# Altium project PnP_Carriage.PrjPcb
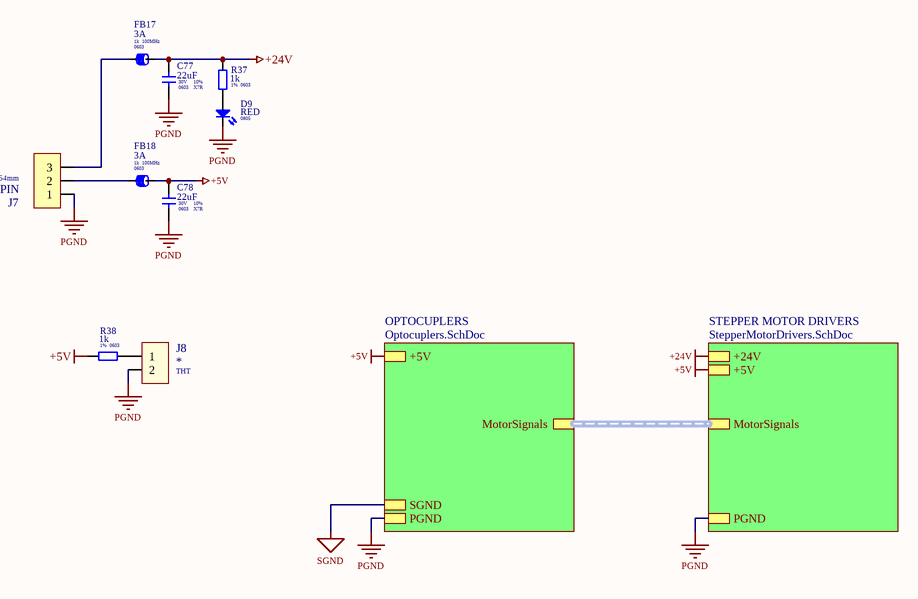
[diagram p0: Root.SchDoc]
3 sheets, 139 parts. Net scope: hierarchical (ports join the sheet entries above them; power ports are global).
Board file: PCB.PcbDoc
Sheets:
  Root.SchDoc
    STEPPER MOTOR DRIVERS = StepperMotorDrivers.SchDoc
    OPTOCUPLERS = Optocuplers.SchDoc

## Sheet Root.SchDoc
size A4; SheetNumber: 1; SheetTotal: 3

### Parts
C77  value 22uF  DielectricType: X7R  Voltage: 30V  Tolerant: 10%  Package: 0603  [CAPC1608X06L]  (hidden comment: 22uF/30V)
C78  value 22uF  DielectricType: X7R  Voltage: 30V  Tolerant: 10%  Package: 0603  [CAPC1608X06L]  (hidden comment: 22uF/30V)
D9  Package: 0805  [DIOMELF1608L]  (hidden comment: RED)
FB17  Min Frequency: 100MHz  Impedance: 1k  Package: 0603  [INDC1608X06N]  (hidden comment: 3A)
FB18  Min Frequency: 100MHz  Impedance: 1k  Package: 0603  [INDC1608X06L]  (hidden comment: 3A)
J7  Package: 2.54mm  [B3B-PH-K-S]  (hidden comment: 3PIN)
J8  Package: THT  [B2B-PH-K-S]  (hidden comment: *)
R37  value 1k  Package: 0603  Tolerance: 1%  [RESC1608X06L]  (hidden comment: 1k 1%)
R38  value 1k  Package: 0603  Tolerance: 1%  [RESC1608X06L]  (hidden comment: 1k 1%)

### Sub-sheets
OPTOCUPLERS = Optocuplers.SchDoc: MotorSignals (harness MotorDriverSignals), +5V, PGND, SGND
STEPPER MOTOR DRIVERS = StepperMotorDrivers.SchDoc: +5V, PGND, +24V, MotorSignals (harness MotorDriverSignals)

### Nets
+5V: C78.2 FB18.2 R38.2 ; sheet STEPPER MOTOR DRIVERS/+5V, sheet OPTOCUPLERS/+5V
+24V: C77.2 FB17.2 R37.2 ; sheet STEPPER MOTOR DRIVERS/+24V
PGND: C77.1 C78.1 D9.2(K) J7.1 J8.2 ; sheet STEPPER MOTOR DRIVERS/PGND, sheet OPTOCUPLERS/PGND
NetD9_1: D9.1(A) R37.1
NetFB17_1: FB17.1 J7.3
NetFB18_1: FB18.1 J7.2
NetJ8_1: J8.1 R38.1

### Buses and harness runs
harness sheet OPTOCUPLERS/MotorSignals = sheet STEPPER MOTOR DRIVERS/MotorSignals

### Notes on the sheet
- Title:
- Size:
- Sheet:
- Revision:
- A4
- of
- SCHEMATIC DIAGRAM
- Variant:
- DrawnBy:
- CheckedBy:
- www.destechnology.pl <http://www.destechnology.pl>
- Date:
- File:

### Library data of the parts
C77 C78 = C: Supplier Part Number 1: *
D9 = D_LED: pin to pad: 1>2 2>1; manufacture: *; helpurl: *; Supplier Part Number 1: *; value: RED
FB17 FB18 = FB_1: Ferrite bead - 2-nd Symbol; manufacture: *; helpurl: *; Supplier Part Number 1: *; value: 3A
J7 = CON_3PIN: WORKPLAN_Code: EP00; value: 3PIN
J8 = CON_2PIN: WORKPLAN_Code: EP00; manufacture: *; helpurl: *; value: *
R37 R38 = R: Supplier Part Number 1: *

## Sheet StepperMotorDrivers.SchDoc: StepperMotorDrivers
size A3 portrait; CheckedBy: DSokol; DrawnBy: MSokol; Revision: 0.1; SheetNumber: 3; SheetTotal: 3
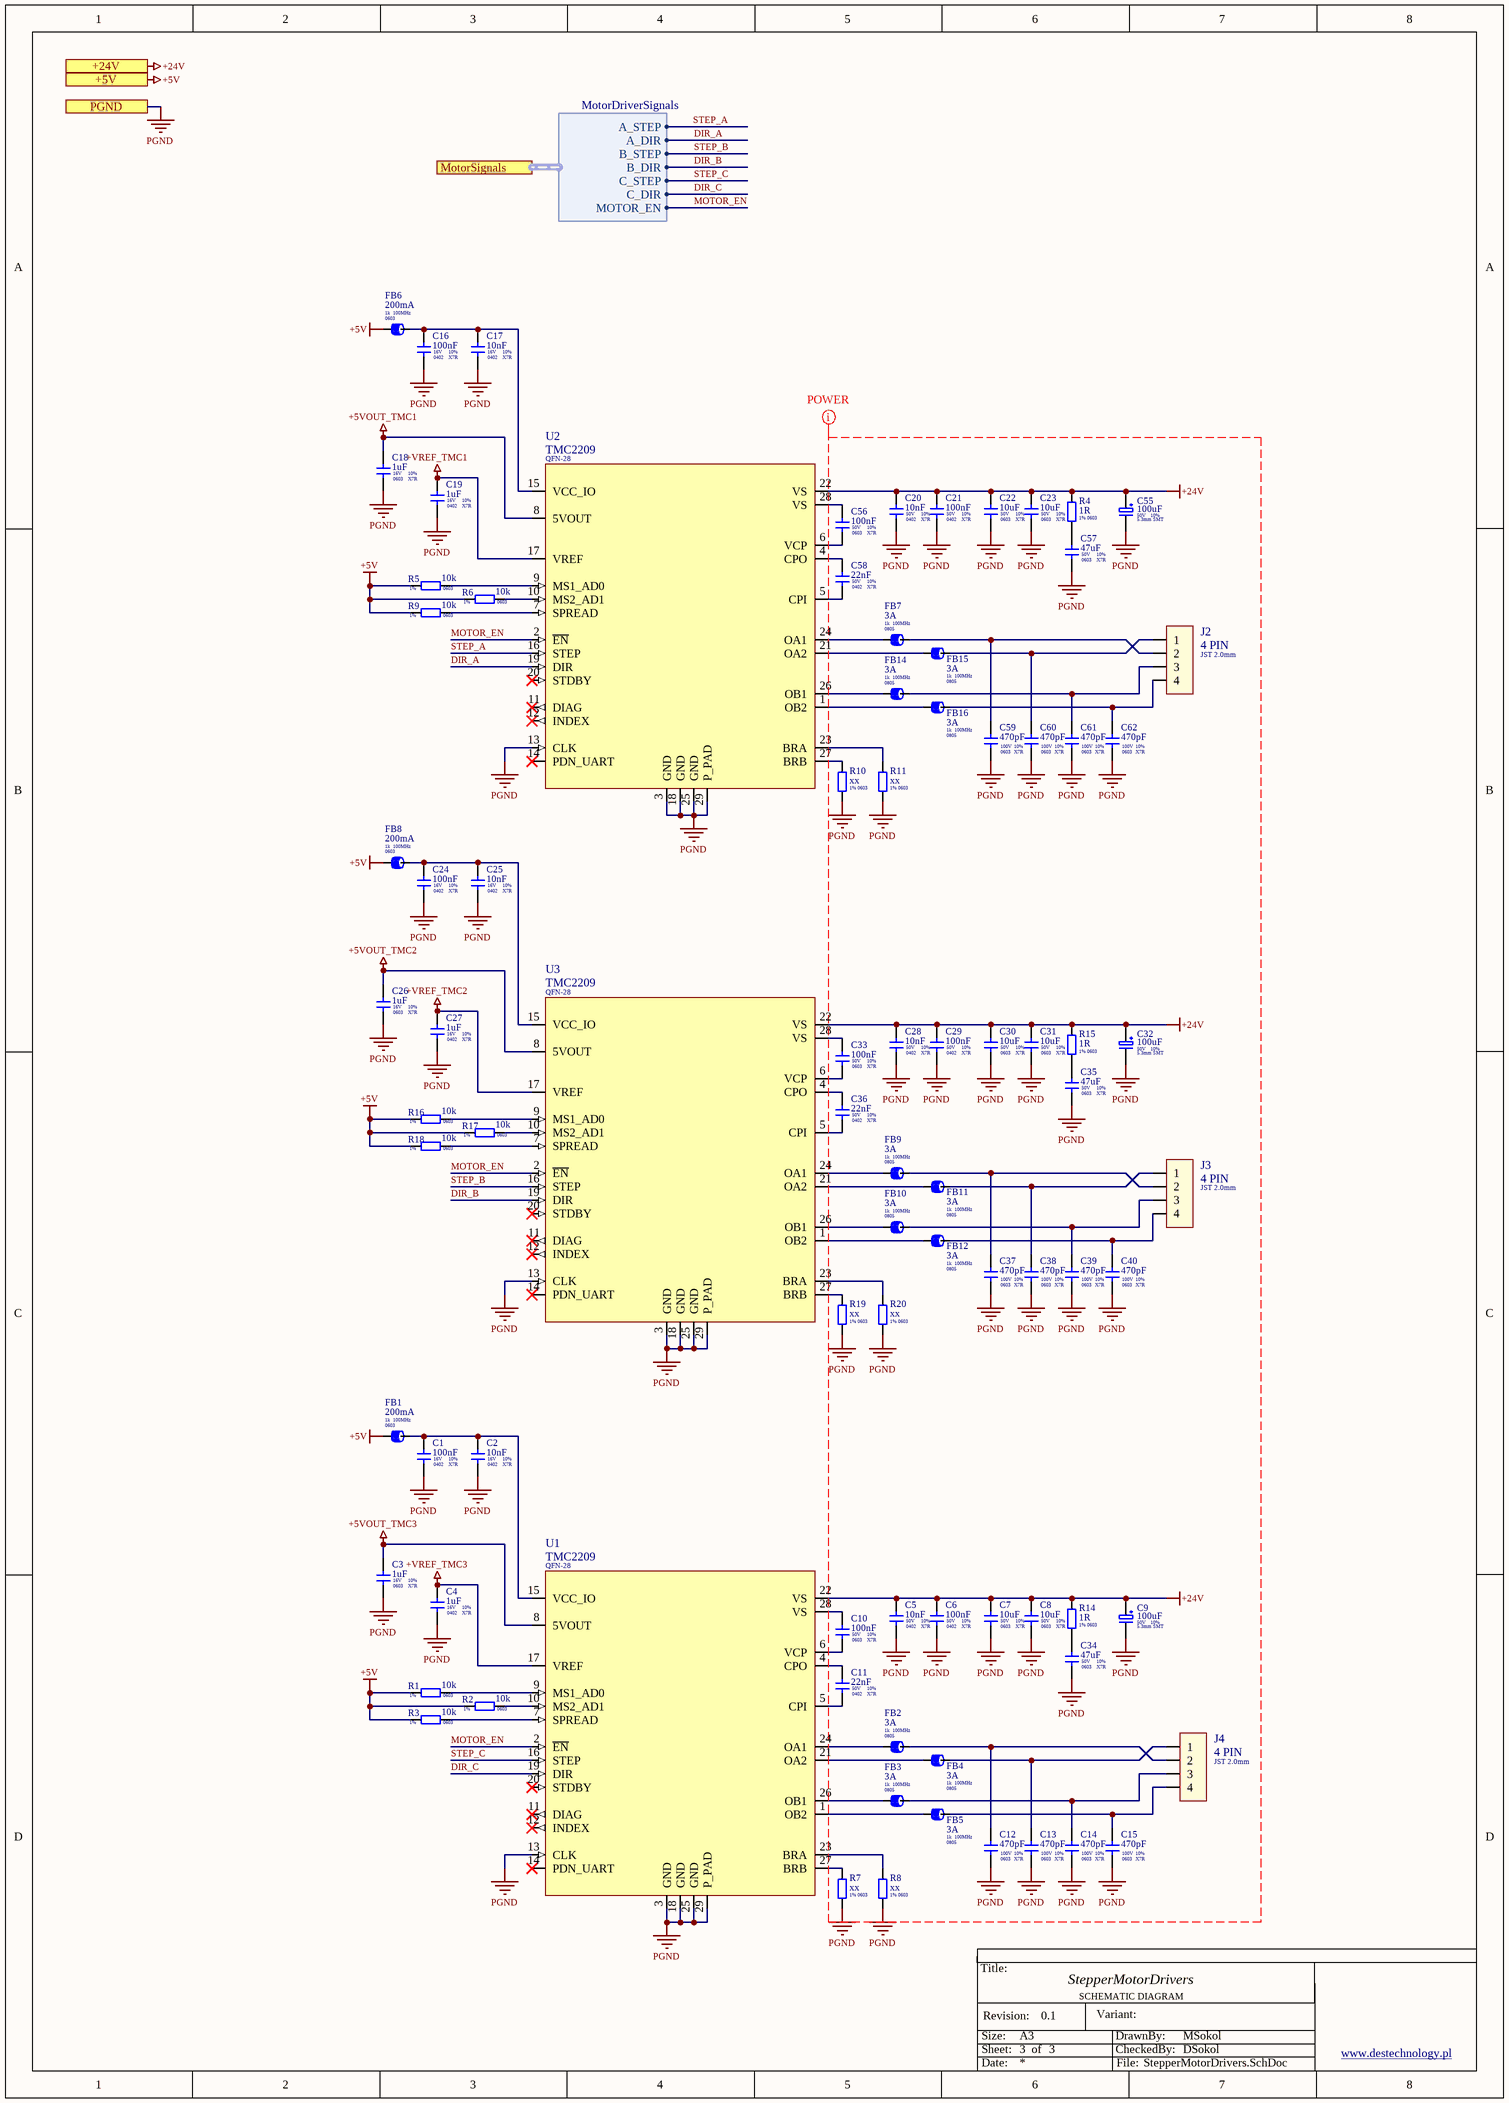
[diagram p1: StepperMotorDrivers.SchDoc]

### Parts
C1  value 100nF  DielectricType: X7R  Voltage: 16V  Tolerant: 10%  Package: 0402  [CAPC1005X04N]  (hidden comment: 100nF/16V)
C2  value 10nF  DielectricType: X7R  Voltage: 16V  Tolerant: 10%  Package: 0402  [CAPC1005X04N]  (hidden comment: 10nF/16V)
C3  value 1uF  DielectricType: X7R  Voltage: 16V  Tolerant: 10%  Package: 0603  [CAPC1608X06N]  (hidden comment: 1uF/16V)
C4  value 1uF  DielectricType: X7R  Voltage: 16V  Tolerant: 10%  Package: 0402  [CAPC1005X04N]  (hidden comment: 1uF/16V)
C5  value 10nF  DielectricType: X7R  Voltage: 50V  Tolerant: 10%  Package: 0402  [CAPC1005X04N]  (hidden comment: 10nF/50V)
C6  value 100nF  DielectricType: X7R  Voltage: 50V  Tolerant: 10%  Package: 0402  [CAPC1005X04N]  (hidden comment: 100nF/50V)
C7  value 10uF  DielectricType: X7R  Voltage: 50V  Tolerant: 10%  Package: 0603  [CAPC1608X06M]  (hidden comment: 10uF/50V)
C8  value 10uF  DielectricType: X7R  Voltage: 50V  Tolerant: 10%  Package: 0603  [CAPC1608X06M]  (hidden comment: 10uF/50V)
C9  value 100uF  Voltage: 50V  Tolerant: 10%  Package: 5.3mm SMT  [CAPAE4543X55L]  (hidden comment: 100uF/50V)
C10  value 100nF  DielectricType: X7R  Voltage: 50V  Tolerant: 10%  Package: 0603  [CAPC1608X06N]  (hidden comment: 100nF/50V)
C11  value 22nF  DielectricType: X7R  Voltage: 50V  Tolerant: 10%  Package: 0402  [CAPC1005X04N]  (hidden comment: 22nF/50V)
C12  value 470pF  DielectricType: X7R  Voltage: 100V  Tolerant: 10%  Package: 0603  [CAPC1608X06L]  (hidden comment: 470pF/100V)
C13  value 470pF  DielectricType: X7R  Voltage: 100V  Tolerant: 10%  Package: 0603  [CAPC1608X06L]  (hidden comment: 470pF/100V)
C14  value 470pF  DielectricType: X7R  Voltage: 100V  Tolerant: 10%  Package: 0603  [CAPC1608X06L]  (hidden comment: 470pF/100V)
C15  value 470pF  DielectricType: X7R  Voltage: 100V  Tolerant: 10%  Package: 0603  [CAPC1608X06L]  (hidden comment: 470pF/100V)
C16  value 100nF  DielectricType: X7R  Voltage: 16V  Tolerant: 10%  Package: 0402  [CAPC1005X04N]  (hidden comment: 100nF/16V)
C17  value 10nF  DielectricType: X7R  Voltage: 16V  Tolerant: 10%  Package: 0402  [CAPC1005X04N]  (hidden comment: 10nF/16V)
C18  value 1uF  DielectricType: X7R  Voltage: 16V  Tolerant: 10%  Package: 0603  [CAPC1608X06N]  (hidden comment: 1uF/16V)
C19  value 1uF  DielectricType: X7R  Voltage: 16V  Tolerant: 10%  Package: 0402  [CAPC1005X04N]  (hidden comment: 1uF/16V)
C20  value 10nF  DielectricType: X7R  Voltage: 50V  Tolerant: 10%  Package: 0402  [CAPC1005X04N]  (hidden comment: 10nF/50V)
C21  value 100nF  DielectricType: X7R  Voltage: 50V  Tolerant: 10%  Package: 0402  [CAPC1005X04N]  (hidden comment: 100nF/50V)
C22  value 10uF  DielectricType: X7R  Voltage: 50V  Tolerant: 10%  Package: 0603  [CAPC1608X06M]  (hidden comment: 10uF/50V)
C23  value 10uF  DielectricType: X7R  Voltage: 50V  Tolerant: 10%  Package: 0603  [CAPC1608X06M]  (hidden comment: 10uF/50V)
C24  value 100nF  DielectricType: X7R  Voltage: 16V  Tolerant: 10%  Package: 0402  [CAPC1005X04N]  (hidden comment: 100nF/16V)
C25  value 10nF  DielectricType: X7R  Voltage: 16V  Tolerant: 10%  Package: 0402  [CAPC1005X04N]  (hidden comment: 10nF/16V)
C26  value 1uF  DielectricType: X7R  Voltage: 16V  Tolerant: 10%  Package: 0603  [CAPC1608X06N]  (hidden comment: 1uF/16V)
C27  value 1uF  DielectricType: X7R  Voltage: 16V  Tolerant: 10%  Package: 0402  [CAPC1005X04N]  (hidden comment: 1uF/16V)
C28  value 10nF  DielectricType: X7R  Voltage: 50V  Tolerant: 10%  Package: 0402  [CAPC1005X04N]  (hidden comment: 10nF/50V)
C29  value 100nF  DielectricType: X7R  Voltage: 50V  Tolerant: 10%  Package: 0402  [CAPC1005X04N]  (hidden comment: 100nF/50V)
C30  value 10uF  DielectricType: X7R  Voltage: 50V  Tolerant: 10%  Package: 0603  [CAPC1608X06M]  (hidden comment: 10uF/50V)
C31  value 10uF  DielectricType: X7R  Voltage: 50V  Tolerant: 10%  Package: 0603  [CAPC1608X06M]  (hidden comment: 10uF/50V)
C32  value 100uF  Voltage: 50V  Tolerant: 10%  Package: 5.3mm SMT  [CAPAE4543X55L]  (hidden comment: 100uF/50V)
C33  value 100nF  DielectricType: X7R  Voltage: 50V  Tolerant: 10%  Package: 0603  [CAPC1608X06N]  (hidden comment: 100nF/50V)
C34  value 47uF  DielectricType: X7R  Voltage: 50V  Tolerant: 10%  Package: 0603  [CAPC1608X06M]  (hidden comment: 47uF/50V)
C35  value 47uF  DielectricType: X7R  Voltage: 50V  Tolerant: 10%  Package: 0603  [CAPC1608X06M]  (hidden comment: 47uF/50V)
C36  value 22nF  DielectricType: X7R  Voltage: 50V  Tolerant: 10%  Package: 0402  [CAPC1005X04N]  (hidden comment: 22nF/50V)
C37  value 470pF  DielectricType: X7R  Voltage: 100V  Tolerant: 10%  Package: 0603  [CAPC1608X06L]  (hidden comment: 470pF/100V)
C38  value 470pF  DielectricType: X7R  Voltage: 100V  Tolerant: 10%  Package: 0603  [CAPC1608X06L]  (hidden comment: 470pF/100V)
C39  value 470pF  DielectricType: X7R  Voltage: 100V  Tolerant: 10%  Package: 0603  [CAPC1608X06L]  (hidden comment: 470pF/100V)
C40  value 470pF  DielectricType: X7R  Voltage: 100V  Tolerant: 10%  Package: 0603  [CAPC1608X06L]  (hidden comment: 470pF/100V)
C55  value 100uF  Voltage: 50V  Tolerant: 10%  Package: 5.3mm SMT  [CAPAE4543X55L]  (hidden comment: 100uF/50V)
C56  value 100nF  DielectricType: X7R  Voltage: 50V  Tolerant: 10%  Package: 0603  [CAPC1608X06N]  (hidden comment: 100nF/50V)
C57  value 47uF  DielectricType: X7R  Voltage: 50V  Tolerant: 10%  Package: 0603  [CAPC1608X06M]  (hidden comment: 47uF/50V)
C58  value 22nF  DielectricType: X7R  Voltage: 50V  Tolerant: 10%  Package: 0402  [CAPC1005X04N]  (hidden comment: 22nF/50V)
C59  value 470pF  DielectricType: X7R  Voltage: 100V  Tolerant: 10%  Package: 0603  [CAPC1608X06L]  (hidden comment: 470pF/100V)
C60  value 470pF  DielectricType: X7R  Voltage: 100V  Tolerant: 10%  Package: 0603  [CAPC1608X06L]  (hidden comment: 470pF/100V)
C61  value 470pF  DielectricType: X7R  Voltage: 100V  Tolerant: 10%  Package: 0603  [CAPC1608X06L]  (hidden comment: 470pF/100V)
C62  value 470pF  DielectricType: X7R  Voltage: 100V  Tolerant: 10%  Package: 0603  [CAPC1608X06L]  (hidden comment: 470pF/100V)
FB1  Min Frequency: 100MHz  Impedance: 1k  Package: 0603  [INDC1608X06N]  (hidden comment: 200mA)
FB2  Min Frequency: 100MHz  Impedance: 1k  Package: 0805  [INDC2012X07N]  (hidden comment: 3A)
FB3  Min Frequency: 100MHz  Impedance: 1k  Package: 0805  [INDC2012X07N]  (hidden comment: 3A)
FB4  Min Frequency: 100MHz  Impedance: 1k  Package: 0805  [INDC2012X07N]  (hidden comment: 3A)
FB5  Min Frequency: 100MHz  Impedance: 1k  Package: 0805  [INDC2012X07N]  (hidden comment: 3A)
FB6  Min Frequency: 100MHz  Impedance: 1k  Package: 0603  [INDC1608X06N]  (hidden comment: 200mA)
FB7  Min Frequency: 100MHz  Impedance: 1k  Package: 0805  [INDC2012X07N]  (hidden comment: 3A)
FB8  Min Frequency: 100MHz  Impedance: 1k  Package: 0603  [INDC1608X06N]  (hidden comment: 200mA)
FB9  Min Frequency: 100MHz  Impedance: 1k  Package: 0805  [INDC2012X07N]  (hidden comment: 3A)
FB10  Min Frequency: 100MHz  Impedance: 1k  Package: 0805  [INDC2012X07N]  (hidden comment: 3A)
FB11  Min Frequency: 100MHz  Impedance: 1k  Package: 0805  [INDC2012X07N]  (hidden comment: 3A)
FB12  Min Frequency: 100MHz  Impedance: 1k  Package: 0805  [INDC2012X07N]  (hidden comment: 3A)
FB14  Min Frequency: 100MHz  Impedance: 1k  Package: 0805  [INDC2012X07N]  (hidden comment: 3A)
FB15  Min Frequency: 100MHz  Impedance: 1k  Package: 0805  [INDC2012X07N]  (hidden comment: 3A)
FB16  Min Frequency: 100MHz  Impedance: 1k  Package: 0805  [INDC2012X07N]  (hidden comment: 3A)
J2  Package: JST 2.0mm  [B4B-PH-K-S]  (hidden comment: 4 PIN)
J3  Package: JST 2.0mm  [B4B-PH-K-S]  (hidden comment: 4 PIN)
J4  Package: JST 2.0mm  [B4B-PH-K-S]  (hidden comment: 4 PIN)
R1  value 10k  Package: 0603  Tolerance: 1%  [RESC1608X06N]  (hidden comment: 10k 1%)
R2  value 10k  Package: 0603  Tolerance: 1%  [RESC1608X06N]  (hidden comment: 10k 1%)
R3  value 10k  Package: 0603  Tolerance: 1%  [RESC1608X06N]  (hidden comment: 10k 1%)
R4  value 1R  Package: 0603  Tolerance: 1%  [RESC1608X06N]  (hidden comment: 1R 1%)
R5  value 10k  Package: 0603  Tolerance: 1%  [RESC1608X06N]  (hidden comment: 10k 1%)
R6  value 10k  Package: 0603  Tolerance: 1%  [RESC1608X06N]  (hidden comment: 10k 1%)
R7  value xx  Package: 0603  Tolerance: 1%  [RESC1608X06N]  (hidden comment: xx 1%)
R8  value xx  Package: 0603  Tolerance: 1%  [RESC1608X06N]  (hidden comment: xx 1%)
R9  value 10k  Package: 0603  Tolerance: 1%  [RESC1608X06N]  (hidden comment: 10k 1%)
R10  value xx  Package: 0603  Tolerance: 1%  [RESC1608X06N]  (hidden comment: xx 1%)
R11  value xx  Package: 0603  Tolerance: 1%  [RESC1608X06N]  (hidden comment: xx 1%)
R14  value 1R  Package: 0603  Tolerance: 1%  [RESC1608X06N]  (hidden comment: 1R 1%)
R15  value 1R  Package: 0603  Tolerance: 1%  [RESC1608X06N]  (hidden comment: 1R 1%)
R16  value 10k  Package: 0603  Tolerance: 1%  [RESC1608X06N]  (hidden comment: 10k 1%)
R17  value 10k  Package: 0603  Tolerance: 1%  [RESC1608X06N]  (hidden comment: 10k 1%)
R18  value 10k  Package: 0603  Tolerance: 1%  [RESC1608X06N]  (hidden comment: 10k 1%)
R19  value xx  Package: 0603  Tolerance: 1%  [RESC1608X06N]  (hidden comment: xx 1%)
R20  value xx  Package: 0603  Tolerance: 1%  [RESC1608X06N]  (hidden comment: xx 1%)
U1  Package: QFN-28  [QFN50P500X500X90_HS-29N]  (hidden comment: TMC2209)
U2  Package: QFN-28  [QFN50P500X500X90_HS-29N]  (hidden comment: TMC2209)
U3  Package: QFN-28  [QFN50P500X500X90_HS-29N]  (hidden comment: TMC2209)

### Ports
+5V, +24V, MotorSignals (harness MotorDriverSignals), PGND

### Harnesses
MotorDriverSignals: A_STEP, A_DIR, B_STEP, B_DIR, C_STEP, C_DIR, MOTOR_EN

### Nets
+5V: FB1.1 FB6.1 FB8.1 R1.1 R2.1 R3.1 R5.1 R6.1 R9.1 R16.1 R17.1 R18.1 ; port +5V
+5VOUT_TMC1: C18.2 U2.8(5VOUT)
+5VOUT_TMC2: C26.2 U3.8(5VOUT)
+5VOUT_TMC3: C3.2 U1.8(5VOUT)
+24V: C5.2 C6.2 C7.2 C8.2 C9.1 C20.2 C21.2 C22.2 C23.2 C28.2 C29.2 C30.2 C31.2 C32.1 C55.1 R4.1 R14.1 R15.1 U1.22(VS) U2.22(VS) U3.22(VS) ; port +24V
+VREF_TMC1: C19.2 U2.17(VREF)
+VREF_TMC2: C27.2 U3.17(VREF)
+VREF_TMC3: C4.2 U1.17(VREF)
PGND: C1.1 C2.1 C3.1 C4.1 C5.1 C6.1 C7.1 C8.1 C9.2 C12.1 C13.1 C14.1 C15.1 C16.1 C17.1 C18.1 C19.1 C20.1 C21.1 C22.1 C23.1 C24.1 C25.1 C26.1 C27.1 C28.1 C29.1 C30.1 C31.1 C32.2 C34.1 C35.1 C37.1 C38.1 C39.1 C40.1 C55.2 C57.1 C59.1 C60.1 C61.1 C62.1 R7.2 R8.2 R10.2 R11.2 R19.2 R20.2 U1.3(GND) U1.13(CLK) U1.18(GND) U1.25(GND) U1.29(P_PAD) U2.3(GND) U2.13(CLK) U2.18(GND) U2.25(GND) U2.29(P_PAD) U3.3(GND) U3.13(CLK) U3.18(GND) U3.25(GND) U3.29(P_PAD) ; port PGND
DIR_A: U2.19(DIR) ; port MotorSignals.A_DIR
DIR_B: U3.19(DIR) ; port MotorSignals.B_DIR
DIR_C: U1.19(DIR) ; port MotorSignals.C_DIR
MOTOR_EN: U1.2(~{EN}) U2.2(~{EN}) U3.2(~{EN}) ; port MotorSignals.MOTOR_EN
STEP_A: U2.16(STEP) ; port MotorSignals.A_STEP
STEP_B: U3.16(STEP) ; port MotorSignals.B_STEP
STEP_C: U1.16(STEP) ; port MotorSignals.C_STEP
NetC1_2: C1.2 C2.2 FB1.2 U1.15(VCC_IO)
NetC10_1: C10.1 U1.6(VCP)
NetC10_2: C10.2 U1.28(VS)
NetC11_1: C11.1 U1.5(CPI)
NetC11_2: C11.2 U1.4(CPO)
NetC12_2: C12.2 FB2.2 J4.2
NetC13_2: C13.2 FB4.2 J4.1
NetC14_2: C14.2 FB3.2 J4.3
NetC15_2: C15.2 FB5.2 J4.4
NetC16_2: C16.2 C17.2 FB6.2 U2.15(VCC_IO)
NetC24_2: C24.2 C25.2 FB8.2 U3.15(VCC_IO)
NetC33_1: C33.1 U3.6(VCP)
NetC33_2: C33.2 U3.28(VS)
NetC34_2: C34.2 R14.2
NetC35_2: C35.2 R15.2
NetC36_1: C36.1 U3.5(CPI)
NetC36_2: C36.2 U3.4(CPO)
NetC37_2: C37.2 FB9.2 J3.2
NetC38_2: C38.2 FB11.2 J3.1
NetC39_2: C39.2 FB10.2 J3.3
NetC40_2: C40.2 FB12.2 J3.4
NetC56_1: C56.1 U2.6(VCP)
NetC56_2: C56.2 U2.28(VS)
NetC57_2: C57.2 R4.2
NetC58_1: C58.1 U2.5(CPI)
NetC58_2: C58.2 U2.4(CPO)
NetC59_2: C59.2 FB7.2 J2.2
NetC60_2: C60.2 FB15.2 J2.1
NetC61_2: C61.2 FB14.2 J2.3
NetC62_2: C62.2 FB16.2 J2.4
NetFB2_1: FB2.1 U1.24(OA1)
NetFB3_1: FB3.1 U1.26(OB1)
NetFB4_1: FB4.1 U1.21(OA2)
NetFB5_1: FB5.1 U1.1(OB2)
NetFB7_1: FB7.1 U2.24(OA1)
NetFB9_1: FB9.1 U3.24(OA1)
NetFB10_1: FB10.1 U3.26(OB1)
NetFB11_1: FB11.1 U3.21(OA2)
NetFB12_1: FB12.1 U3.1(OB2)
NetFB14_1: FB14.1 U2.26(OB1)
NetFB15_1: FB15.1 U2.21(OA2)
NetFB16_1: FB16.1 U2.1(OB2)
NetR1_2: R1.2 U1.9(MS1_AD0)
NetR2_2: R2.2 U1.10(MS2_AD1)
NetR3_2: R3.2 U1.7(SPREAD)
NetR5_2: R5.2 U2.9(MS1_AD0)
NetR6_2: R6.2 U2.10(MS2_AD1)
NetR7_1: R7.1 U1.27(BRB)
NetR8_1: R8.1 U1.23(BRA)
NetR9_2: R9.2 U2.7(SPREAD)
NetR10_1: R10.1 U2.27(BRB)
NetR11_1: R11.1 U2.23(BRA)
NetR16_2: R16.2 U3.9(MS1_AD0)
NetR17_2: R17.2 U3.10(MS2_AD1)
NetR18_2: R18.2 U3.7(SPREAD)
NetR19_1: R19.1 U3.27(BRB)
NetR20_1: R20.1 U3.23(BRA)

Not connected (* = marked no-connect by the designer): U1 11(DIAG)* 12(INDEX)* 14(PDN_UART)* 20(STDBY)*; U2 11(DIAG)* 12(INDEX)* 14(PDN_UART)* 20(STDBY)*; U3 11(DIAG)* 12(INDEX)* 14(PDN_UART)* 20(STDBY)*

### Layout directives
net class POWER: +24V, PGND

### Notes on the sheet
- Title:
- Size:
- Sheet:
- Revision:
- A3
- of
- SCHEMATIC DIAGRAM
- Variant:
- DrawnBy:
- CheckedBy:
- www.destechnology.pl <http://www.destechnology.pl>
- Date:
- File:

### Library data of the parts
C1-C8 C10-C31 C33-C40 C56-C62 = C: Supplier Part Number 1: *
C9 C32 C55 = C_EL: Supplier Part Number 1: *
FB1-FB12 FB14-FB16 = FB_1: Ferrite bead - 2-nd Symbol; manufacture: *; helpurl: *; Supplier Part Number 1: *
  FB1 FB6 FB8: value: 200mA
  FB2-FB5 FB7 FB9-FB12 FB14-FB16: value: 3A
J2-J4 = CON_4PIN: Manufacture: *; helpurl: *; value: 4 PIN
R1-R11 R14-R20 = R: Supplier Part Number 1: *
U1-U3 = TMC2209: Universal high voltage driver for two-phase bipolar stepper motor. stealthChop™ for quiet  movement. Integrated MOSFETs for up to 2A motor current per coil. With Step/Dir Interface and UART.; Unique ID: *; Helpurl: *; Value: TMC2209

## Sheet Optocuplers.SchDoc: Optocuplers
size A3; CheckedBy: DSokol; DrawnBy: MSokol; Revision: 0.1; SheetNumber: 2; SheetTotal: 3
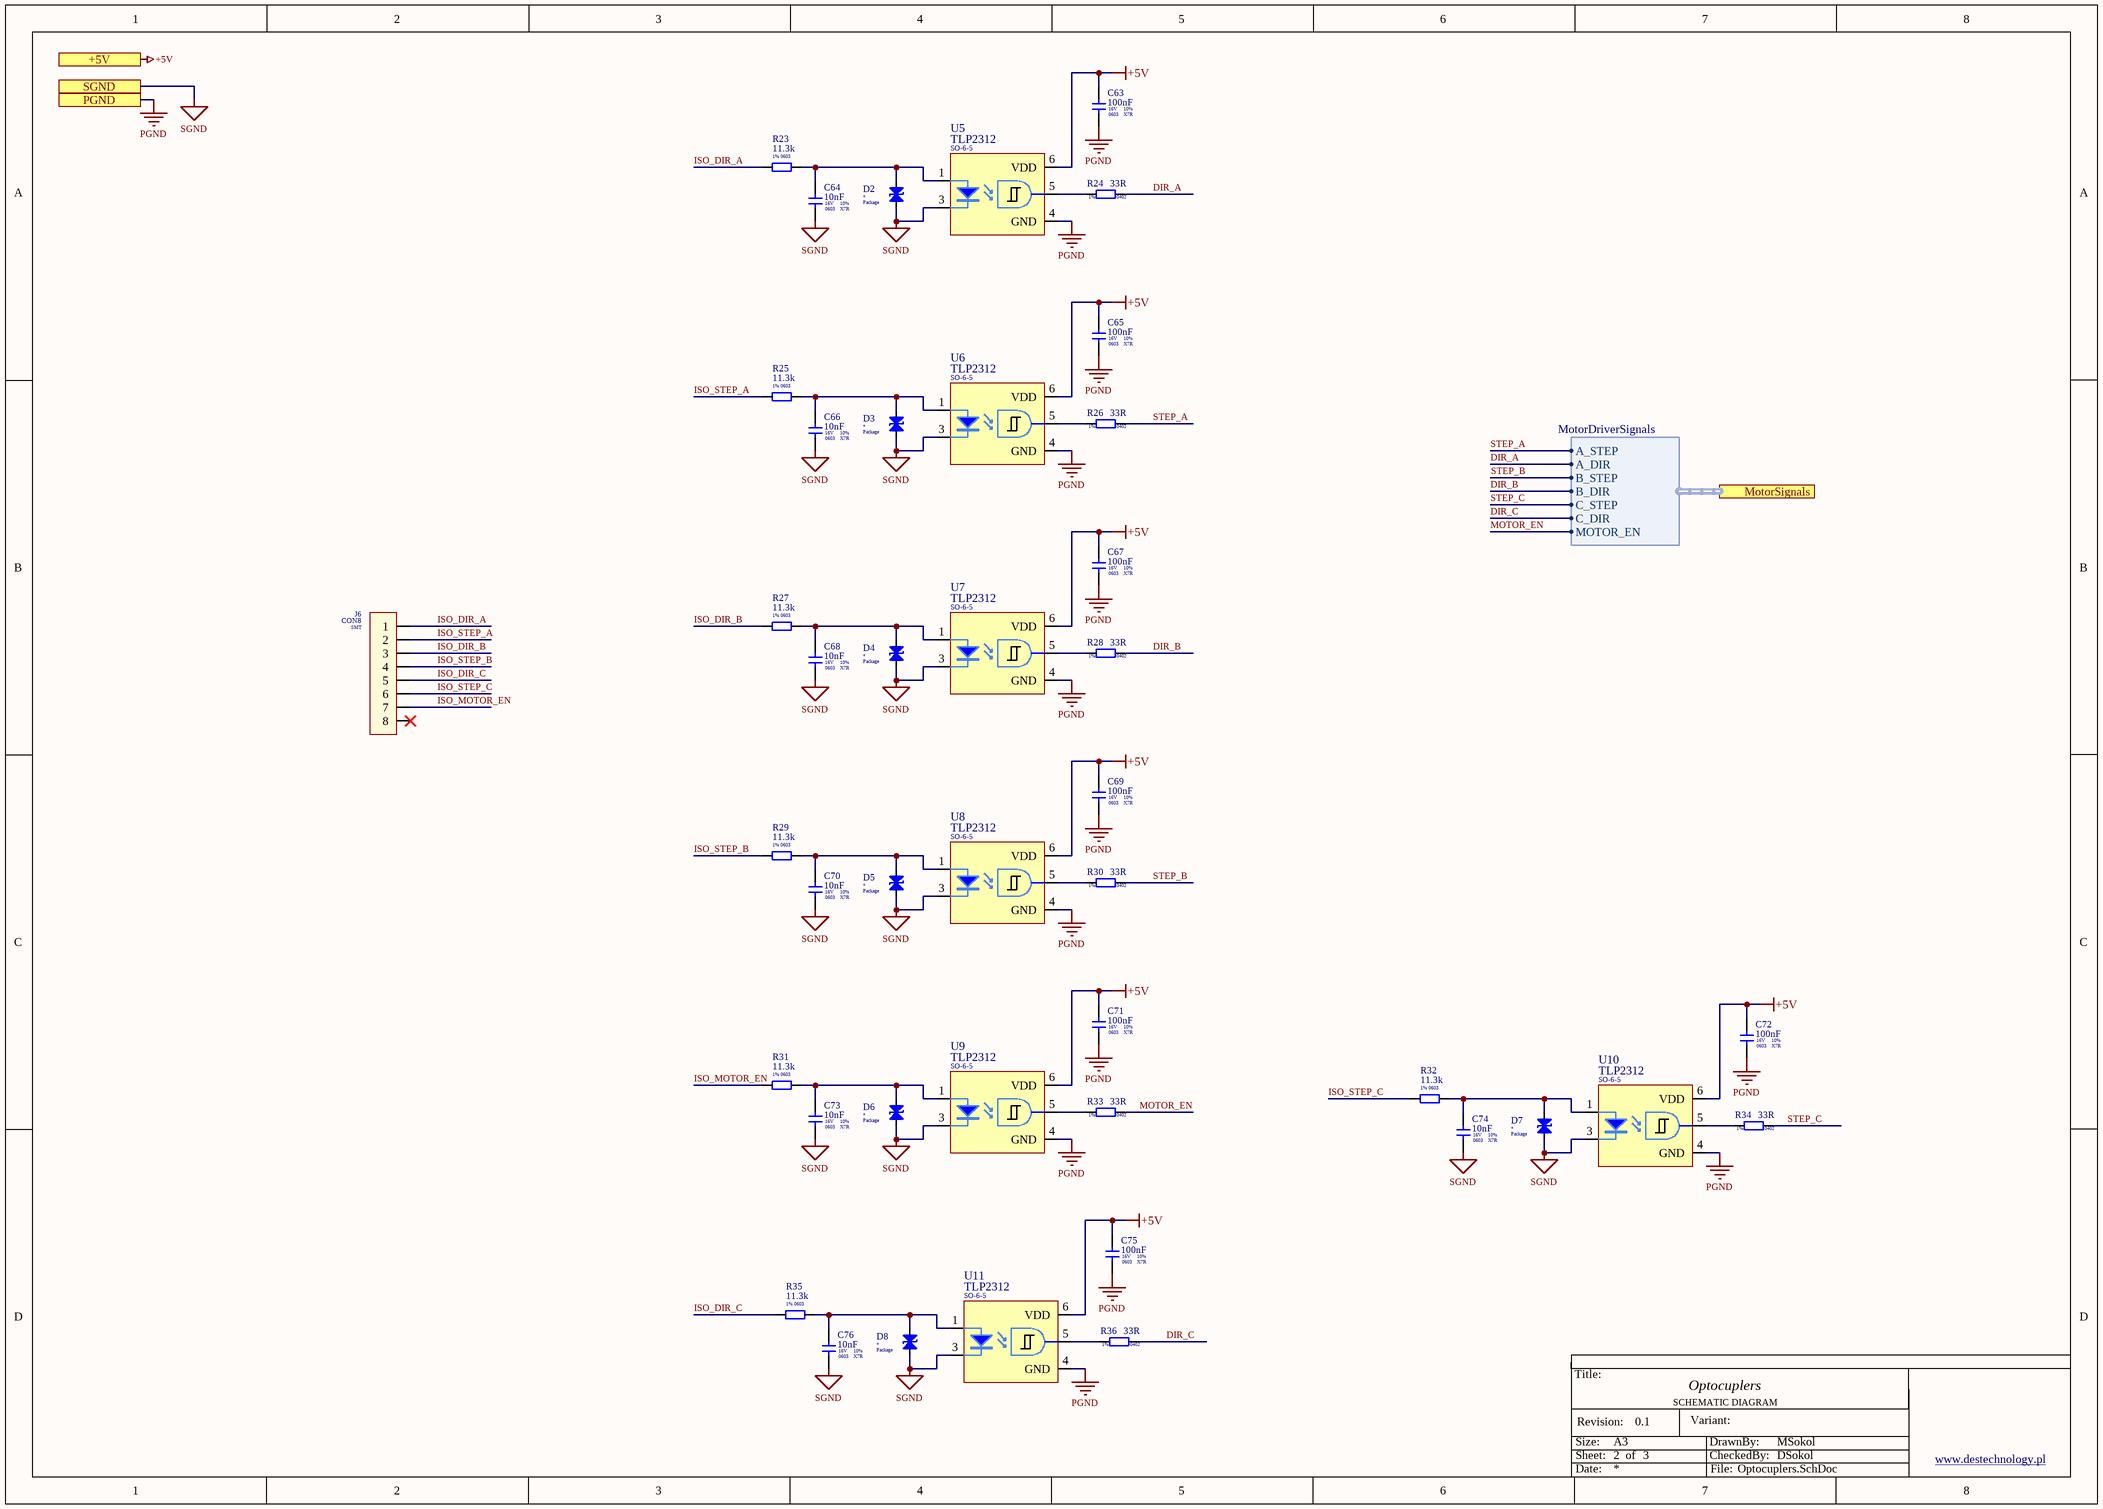
[diagram p2: Optocuplers.SchDoc]

### Parts
C63  value 100nF  DielectricType: X7R  Voltage: 16V  Tolerant: 10%  Package: 0603  [CAPC1608X06M]  (hidden comment: 100nF/16V)
C64  value 10nF  DielectricType: X7R  Voltage: 16V  Tolerant: 10%  Package: 0603  [CAPC1608X06M]  (hidden comment: 10nF/16V)
C65  value 100nF  DielectricType: X7R  Voltage: 16V  Tolerant: 10%  Package: 0603  [CAPC1608X06M]  (hidden comment: 100nF/16V)
C66  value 10nF  DielectricType: X7R  Voltage: 16V  Tolerant: 10%  Package: 0603  [CAPC1608X06M]  (hidden comment: 10nF/16V)
C67  value 100nF  DielectricType: X7R  Voltage: 16V  Tolerant: 10%  Package: 0603  [CAPC1608X06M]  (hidden comment: 100nF/16V)
C68  value 10nF  DielectricType: X7R  Voltage: 16V  Tolerant: 10%  Package: 0603  [CAPC1608X06M]  (hidden comment: 10nF/16V)
C69  value 100nF  DielectricType: X7R  Voltage: 16V  Tolerant: 10%  Package: 0603  [CAPC1608X06M]  (hidden comment: 100nF/16V)
C70  value 10nF  DielectricType: X7R  Voltage: 16V  Tolerant: 10%  Package: 0603  [CAPC1608X06M]  (hidden comment: 10nF/16V)
C71  value 100nF  DielectricType: X7R  Voltage: 16V  Tolerant: 10%  Package: 0603  [CAPC1608X06M]  (hidden comment: 100nF/16V)
C72  value 100nF  DielectricType: X7R  Voltage: 16V  Tolerant: 10%  Package: 0603  [CAPC1608X06M]  (hidden comment: 100nF/16V)
C73  value 10nF  DielectricType: X7R  Voltage: 16V  Tolerant: 10%  Package: 0603  [CAPC1608X06M]  (hidden comment: 10nF/16V)
C74  value 10nF  DielectricType: X7R  Voltage: 16V  Tolerant: 10%  Package: 0603  [CAPC1608X06M]  (hidden comment: 10nF/16V)
C75  value 100nF  DielectricType: X7R  Voltage: 16V  Tolerant: 10%  Package: 0603  [CAPC1608X06M]  (hidden comment: 100nF/16V)
C76  value 10nF  DielectricType: X7R  Voltage: 16V  Tolerant: 10%  Package: 0603  [CAPC1608X06M]  (hidden comment: 10nF/16V)
D2  *  [SODFL250X90-2N]
D3  *  [SODFL250X90-2N]
D4  *  [SODFL250X90-2N]
D5  *  [SODFL250X90-2N]
D6  *  [SODFL250X90-2N]
D7  *  [SODFL250X90-2N]
D8  *  [SODFL250X90-2N]
J6  Package: SMT  [B8B-PH-K-S]  (hidden comment: CON8)
R23  value 11.3k  Package: 0603  Tolerance: 1%  [RESC1608X06M]  (hidden comment: 11.3k 1%)
R24  value 33R  Package: 0402  Tolerance: 1%  [RESC1005X03L]  (hidden comment: 33R 1%)
R25  value 11.3k  Package: 0603  Tolerance: 1%  [RESC1608X06M]  (hidden comment: 11.3k 1%)
R26  value 33R  Package: 0402  Tolerance: 1%  [RESC1005X03L]  (hidden comment: 33R 1%)
R27  value 11.3k  Package: 0603  Tolerance: 1%  [RESC1608X06M]  (hidden comment: 11.3k 1%)
R28  value 33R  Package: 0402  Tolerance: 1%  [RESC1005X03L]  (hidden comment: 33R 1%)
R29  value 11.3k  Package: 0603  Tolerance: 1%  [RESC1608X06M]  (hidden comment: 11.3k 1%)
R30  value 33R  Package: 0402  Tolerance: 1%  [RESC1005X03L]  (hidden comment: 33R 1%)
R31  value 11.3k  Package: 0603  Tolerance: 1%  [RESC1608X06M]  (hidden comment: 11.3k 1%)
R32  value 11.3k  Package: 0603  Tolerance: 1%  [RESC1608X06N]  (hidden comment: 11.3k 1%)
R33  value 33R  Package: 0402  Tolerance: 1%  [RESC1005X03L]  (hidden comment: 33R 1%)
R34  value 33R  Package: 0402  Tolerance: 1%  [RESC1005X03L]  (hidden comment: 33R 1%)
R35  value 11.3k  Package: 0603  Tolerance: 1%  [RESC1608X06M]  (hidden comment: 11.3k 1%)
R36  value 33R  Package: 0402  Tolerance: 1%  [RESC1005X03L]  (hidden comment: 33R 1%)
U5  TLP2312  [SO-6-5]
U6  TLP2312  [SO-6-5]
U7  TLP2312  [SO-6-5]
U8  TLP2312  [SO-6-5]
U9  TLP2312  [SO-6-5]
U10  TLP2312  [SO-6-5]
U11  TLP2312  [SO-6-5]

### Ports
+5V, MotorSignals (harness MotorDriverSignals), PGND, SGND

### Harnesses
MotorDriverSignals: A_STEP, A_DIR, B_STEP, B_DIR, C_STEP, C_DIR, MOTOR_EN

### Nets
+5V: C63.2 C65.2 C67.2 C69.2 C71.2 C72.2 C75.2 U5.6(VDD) U6.6(VDD) U7.6(VDD) U8.6(VDD) U9.6(VDD) U10.6(VDD) U11.6(VDD) ; port +5V
PGND: C63.1 C65.1 C67.1 C69.1 C71.1 C72.1 C75.1 U5.4(GND) U6.4(GND) U7.4(GND) U8.4(GND) U9.4(GND) U10.4(GND) U11.4(GND) ; port PGND
SGND: C64.1 C66.1 C68.1 C70.1 C73.1 C74.1 C76.1 D2.1(A) D3.1(A) D4.1(A) D5.1(A) D6.1(A) D7.1(A) D8.1(A) U5.3(K) U6.3(K) U7.3(K) U8.3(K) U9.3(K) U10.3(K) U11.3(K) ; port SGND
DIR_A: R24.1 ; port MotorSignals.A_DIR
DIR_B: R28.1 ; port MotorSignals.B_DIR
DIR_C: R36.1 ; port MotorSignals.C_DIR
ISO_DIR_A: J6.1 R23.1
ISO_DIR_B: J6.3 R27.1
ISO_DIR_C: J6.5 R35.1
ISO_MOTOR_EN: J6.7 R31.1
ISO_STEP_A: J6.2 R25.1
ISO_STEP_B: J6.4 R29.1
ISO_STEP_C: J6.6 R32.1
MOTOR_EN: R33.1 ; port MotorSignals.MOTOR_EN
STEP_A: R26.1 ; port MotorSignals.A_STEP
STEP_B: R30.1 ; port MotorSignals.B_STEP
STEP_C: R34.1 ; port MotorSignals.C_STEP
NetC64_2: C64.2 D2.2(K) R23.2 U5.1(A)
NetC66_2: C66.2 D3.2(K) R25.2 U6.1(A)
NetC68_2: C68.2 D4.2(K) R27.2 U7.1(A)
NetC70_2: C70.2 D5.2(K) R29.2 U8.1(A)
NetC73_2: C73.2 D6.2(K) R31.2 U9.1(A)
NetC74_2: C74.2 D7.2(K) R32.2 U10.1(A)
NetC76_2: C76.2 D8.2(K) R35.2 U11.1(A)
NetR24_2: R24.2 U5.5(Vo)
NetR26_2: R26.2 U6.5(Vo)
NetR28_2: R28.2 U7.5(Vo)
NetR30_2: R30.2 U8.5(Vo)
NetR33_2: R33.2 U9.5(Vo)
NetR34_2: R34.2 U10.5(Vo)
NetR36_2: R36.2 U11.5(Vo)

Not connected (* = marked no-connect by the designer): J6 8*

### Notes on the sheet
- Title:
- Size:
- Sheet:
- Revision:
- A3
- of
- SCHEMATIC DIAGRAM
- Variant:
- DrawnBy:
- CheckedBy:
- www.destechnology.pl <http://www.destechnology.pl>
- Date:
- File:

### Library data of the parts
C63-C76 = C: Supplier Part Number 1: *
D2-D8 = D_TRANSIL1: Manufacture: *; helpurl: *; Package: Package; value: *
J6 = CON_8PIN: value: CON8
R23-R36 = R
  R23 R25 R27 R29 R31 R32 R35: Supplier Part Number 1: *
  R24 R26 R28 R30 R33 R34 R36: Supplier Part Number 1: CRCW040233R0FKED
U5-U11 = TLP2312: High Speed Optocouplers High speed photocoupler; 5pin SO6; manufacturer: Toshiba; helpurl: https://www.mouser.pl/datasheet/3/105/1/D78E77339B69F00393F891A3B84C497312BF0481D7045F2AF290AB6A5F48831E.pdf; case: SO-6-5; value: TLP2312

## Nets that join several sheets
+5V: Root (C78.2 FB18.2 R38.2), StepperMotorDrivers (12 pins), Optocuplers (14 pins)
+24V: Root (C77.2 FB17.2 R37.2), StepperMotorDrivers (21 pins)
PGND: Root (5 pins), StepperMotorDrivers (63 pins), Optocuplers (14 pins)
DIR_A: StepperMotorDrivers (U2.19), Optocuplers (R24.1)
DIR_B: StepperMotorDrivers (U3.19), Optocuplers (R28.1)
DIR_C: StepperMotorDrivers (U1.19), Optocuplers (R36.1)
MOTOR_EN: StepperMotorDrivers (U1.2 U2.2 U3.2), Optocuplers (R33.1)
STEP_A: StepperMotorDrivers (U2.16), Optocuplers (R26.1)
STEP_B: StepperMotorDrivers (U3.16), Optocuplers (R30.1)
STEP_C: StepperMotorDrivers (U1.16), Optocuplers (R34.1)